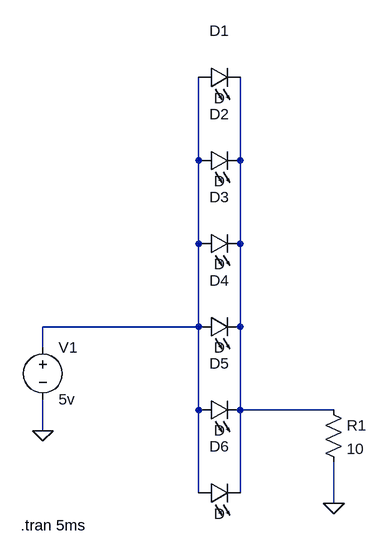
[diagram p0: schematic Draft1.asc]
Draft1.asc, the LTspice schematic file:
Version 4
SHEET 1 880 852
WIRE 256 208 256 80
WIRE 320 208 320 80
WIRE 256 336 256 208
WIRE 320 336 320 208
WIRE 256 464 256 336
WIRE 256 464 16 464
WIRE 320 464 320 336
WIRE 16 496 16 464
WIRE 256 592 256 464
WIRE 320 592 320 464
WIRE 464 592 320 592
WIRE 16 624 16 576
WIRE 256 720 256 592
WIRE 320 720 320 592
WIRE 464 736 464 672
FLAG 464 736 0
FLAG 16 624 0
SYMBOL LED 256 96 R270
WINDOW 0 72 32 VTop 2
WINDOW 3 0 32 VBottom 2
SYMATTR InstName D1
SYMBOL LED 256 224 R270
WINDOW 0 72 32 VTop 2
WINDOW 3 0 32 VBottom 2
SYMATTR InstName D2
SYMBOL LED 256 352 R270
WINDOW 0 72 32 VTop 2
WINDOW 3 0 32 VBottom 2
SYMATTR InstName D3
SYMBOL LED 256 480 R270
WINDOW 0 72 32 VTop 2
WINDOW 3 0 32 VBottom 2
SYMATTR InstName D4
SYMBOL LED 256 608 R270
WINDOW 0 72 32 VTop 2
WINDOW 3 0 32 VBottom 2
SYMATTR InstName D5
SYMBOL LED 256 736 R270
WINDOW 0 72 32 VTop 2
WINDOW 3 0 32 VBottom 2
SYMATTR InstName D6
SYMBOL res 448 576 R0
SYMATTR InstName R1
SYMATTR Value 10
SYMBOL voltage 16 480 R0
WINDOW 123 0 0 Left 0
WINDOW 39 0 0 Left 0
SYMATTR InstName V1
SYMATTR Value 5v
TEXT -18 770 Left 2 !.tran 5ms

The netlist it stands for:
* Draft1.asc
D1 N001 N002 D
D2 N001 N002 D
D3 N001 N002 D
D4 N001 N002 D
D5 N001 N002 D
D6 N001 N002 D
R1 N002 0 10
V1 N001 0 5v
.model D D
.lib standard.dio
.tran 5ms
.backanno
.end